# EAGLE design IQRB-1_Evo_board (EAGLE 9.7.0)
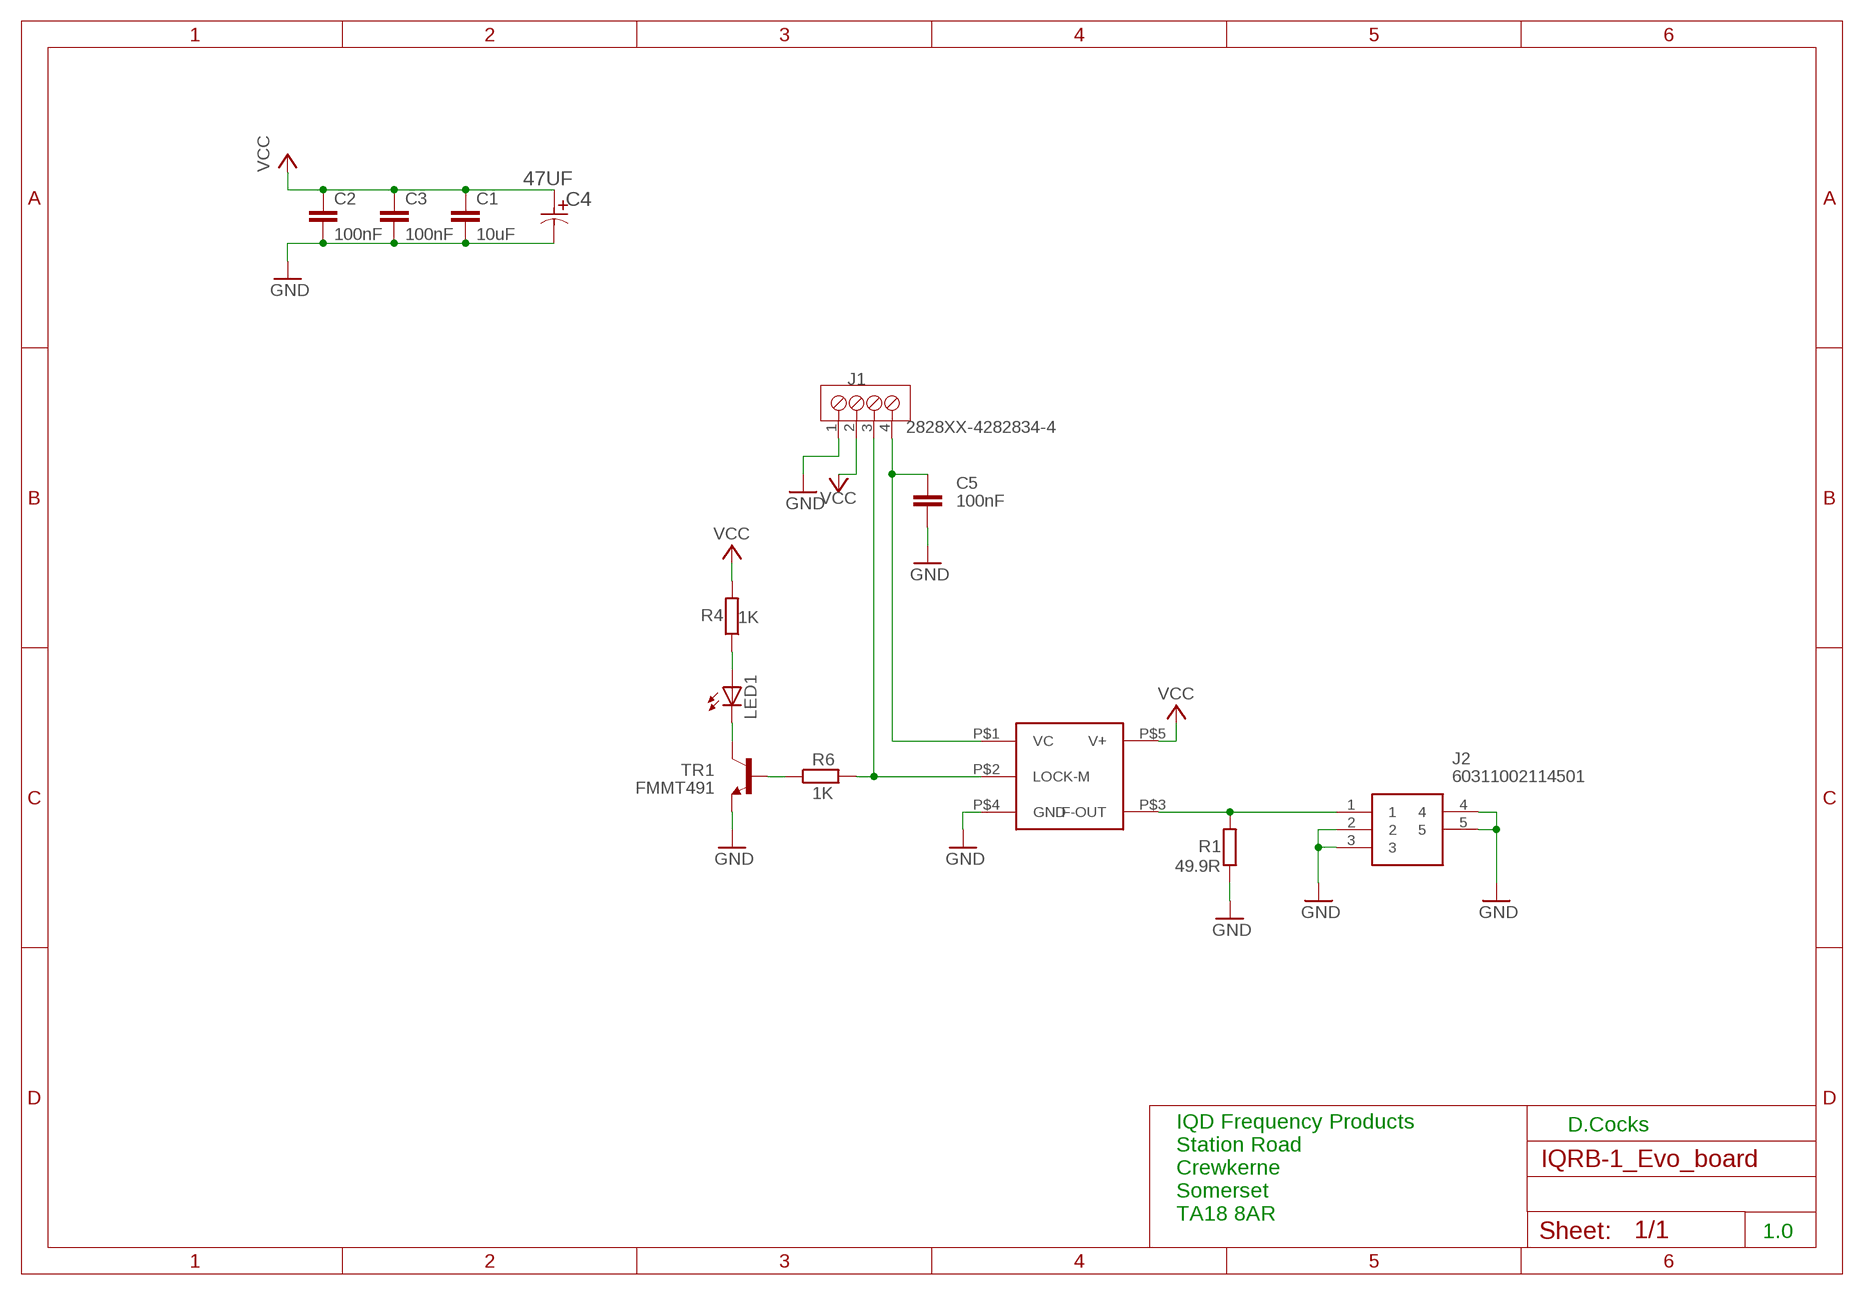
[diagram p0: schematic, sheet 1]

## Parts
C1  10uF  C-EUC0805  [C0805]
C2  100nF  C-EUC0805  [C0805]
C3  100nF  C-EUC0805  [C0805]
C4  47UF  EEE-FK0J101UR-CASE-C  [CAPAE530X610N]
C5  100nF  C-EUC0805  [C0805]
J1  2828XX-4282834-4  [TERMBLK_254-4N]
J2  60311002114501  60312002114503  [60312002114503]
LED1  LEDCHIP-LED0805  [CHIP-LED0805]
R1  49.9R  R-EU_M1206  [M1206]
R4  1K  R-EU_M0805  [M0805]
R6  1K  R-EU_M0805  [M0805]
TR1  FMMT491  BC817-16LT1SMD  [SOT23-BEC]
U$1  RB1-DEVRUBID  [RB1-PACK]

## Nets
GND: C1.2 C2.2 C3.2 C4.2 C5.2 J1.1 J2.2 J2.3 J2.4 J2.5 R1.1 TR1.E U$1.P$4(GND)
N$1: R6.1 TR1.B
N$2: J2.1 R1.2 U$1.P$3(F-OUT)
N$3: LED1.C TR1.C
N$4: LED1.A R4.1
N$5: J1.3 R6.2 U$1.P$2(LOCK-M)
N$6: C5.1 J1.4 U$1.P$1(VC)
VCC: C1.1 C2.1 C3.1 C4.1 J1.2 R4.2 U$1.P$5(V+)

## Notes on the sheet
- D.Cocks
- IQD Frequency Products
  Station Road
  Crewkerne
  Somerset
  TA18 8AR
- 1.0

## Library data of the parts
C1-C3 C5 = resistor:C-EU: CAPACITOR, European symbol
C4 = Panasonic-EEEFK_EEEFP:EEE-: Aluminum Electrolytic Capacitors,Surface Mount Type; MPN: EEE-FK0J101UR; OC_FARNELL: 1850085; OC_NEWARK: 23T0829; PACKAGE: CASE-C; SUPPLIER: PANASONIC; TOLERANCE: ±20 %; VALUE: 100UF; VOLTAGERATING: 6.3V
J1 = Connector:2828XX-4: 4 Position Wire to Board Terminal Block Horizontal with Board Reference: Datasheet <https://www.te.com.cn/commerce/DocumentDelivery/DDEController?Action=showdoc&DocId=Catalog+Section%7F1308389_EUROSTYLE_TERMINAL_BLOCKS%7F0607%7Fpdf%7FEnglish%7FENG_CS_1308389_EUROSTYLE_TERMINAL_BLOCKS_0607.pdf%7F2-282837-5>; CATEGORY: Connectors; DATASHEET: https://www.te.com/usa-en/product-282834-4.datasheet.pdf; DESCRIPTION: 4 Position Wire to Board Terminal Block Horizontal with Board 0.100" (2.54mm) Through Hole; MANUFACTURER: TE Connectivity AMP Connectors; MPN: 282834-4; OPERATING_TEMPERATURE: -40°C ~ 105°C; PACKAGE_SIZE: NA; PACKAGE_TYPE: Through Hole; PART_STATUS: Active; PITCH: 0.100" (2.54mm); ROHS: Compliant; SERIES: Buchanan; SUBCATEGORY: Terminal Blocks; TYPE: Screw Terminal - Rising Cage Clamp Side Wire Entry
J2 = 60312002114503:60312002114503: Wurth Elektronik, WR-SMA Straight PCB Mount Coaxial Connector, jack, Gold over Nickel, Solder Termination Source: Datasheet <https://katalog.we-online.de/em/datasheet/60312002114503.pdf>; DESCRIPTION: Wurth Elektronik, WR-SMA Straight PCB Mount Coaxial Connector, jack, Gold over Nickel, Solder Termination; HEIGHT: 9.56mm; MANUFACTURER_NAME: Wurth Elektronik; MANUFACTURER_PART_NUMBER: 60312002114503; MOUSER_PART_NUMBER: 710-60312002114503; MOUSER_PRICE-STOCK: https://www.mouser.co.uk/ProductDetail/Wurth-Elektronik/60312002114503?qs=3jNSNtuqJTL%2FGpZA1FAOxw%3D%3D
LED1 = led:LED: LED OSRAM: - CHIPLED LG R971, LG N971, LY N971, LG Q971, LY Q971, LO R971, LY R971 LH N974, LH R974 LS Q976, LO Q976, LY Q976 LO Q996 - Hyper CHIPLED LW Q18S LB Q993, LB Q99A, LB R99A - SideLED LS A670, LO A670, LY A670, LG A670, LP A670 LB A673, LV A673, LT A673, LW A673 LH A674 LY A675 LS A676, LA A676, LO A676, LY A676, LW A676 LS A679, LY A679, LG A679 - Hyper Micro SIDELED® LS Y876, LA Y876, LO Y876, LY Y876 LT Y87S - SmartLED LW L88C, LW L88S LB L89C, LB L89S, LG L890 LS L89K, LO L89K, LY L89K LS L896, LA L896, LO L896, LY L896 - TOPLED LS T670, LO T670, LY T670, LG T670, LP T670 LSG T670, LSP T670, LSY T670, LOP T670, LYG T670 LG T671, LOG T671, LSG T671 LB T673, LV T673, LT T673, LW T673 LH T674 LS T676, LA T676, LO T676, LY T676, LB T676, LH T676, LSB T676, LW T676 LB T67C, LV T67C, LT T67C, LS T67K, LO T67K, LY T67K, LW E67C LS E67B, LA E67B, LO E67B, LY E67B, LB E67C, LV E67C, LT E67C LW T67C LS T679, LY T679, LG T679 LS T770, LO T770, LY T770, LG T770, LP T770 LB T773, LV T773, LT T773, LW T773 LH T774 LS E675, LA E675, LY E675, LS T675 LS T776, LA T776, LO T776, LY T776, LB T776 LHGB T686 LT T68C, LB T68C - Hyper Mini TOPLED® LB M676 - Mini TOPLED Santana® LG M470 LS M47K, LO M47K, LY M47K Source: http://www.osram.convergy.de LUXEON: - LUMILED® LXK2-PW12-R00, LXK2-PW12-S00, LXK2-PW14-U00, LXK2-PW14-V00 LXK2-PM12-R00, LXK2-PM12-S00, LXK2-PM14-U00 LXK2-PE12-Q00, LXK2-PE12-R00, LXK2-PE12-S00, LXK2-PE14-T00, LXK2-PE14-U00 LXK2-PB12-K00, LXK2-PB12-L00, LXK2-PB12-M00, LXK2-PB14-N00, LXK2-PB14-P00, LXK2-PB14-Q00 LXK2-PR12-L00, LXK2-PR12-M00, LXK2-PR14-Q00, LXK2-PR14-R00 LXK2-PD12-Q00, LXK2-PD12-R00, LXK2-PD12-S00 LXK2-PH12-R00, LXK2-PH12-S00 LXK2-PL12-P00, LXK2-PL12-Q00, LXK2-PL12-R00 Source: www.luxeon.com KINGBRIGHT: KA-3528ASYC Source: www.kingbright.com
R1 R4 R6 = resistor:R-EU_: RESISTOR, European symbol
TR1 = transistor-npn:BC817*: NPN Transistor
U$1 = IQDcrystal:RB1-DEV

## Board
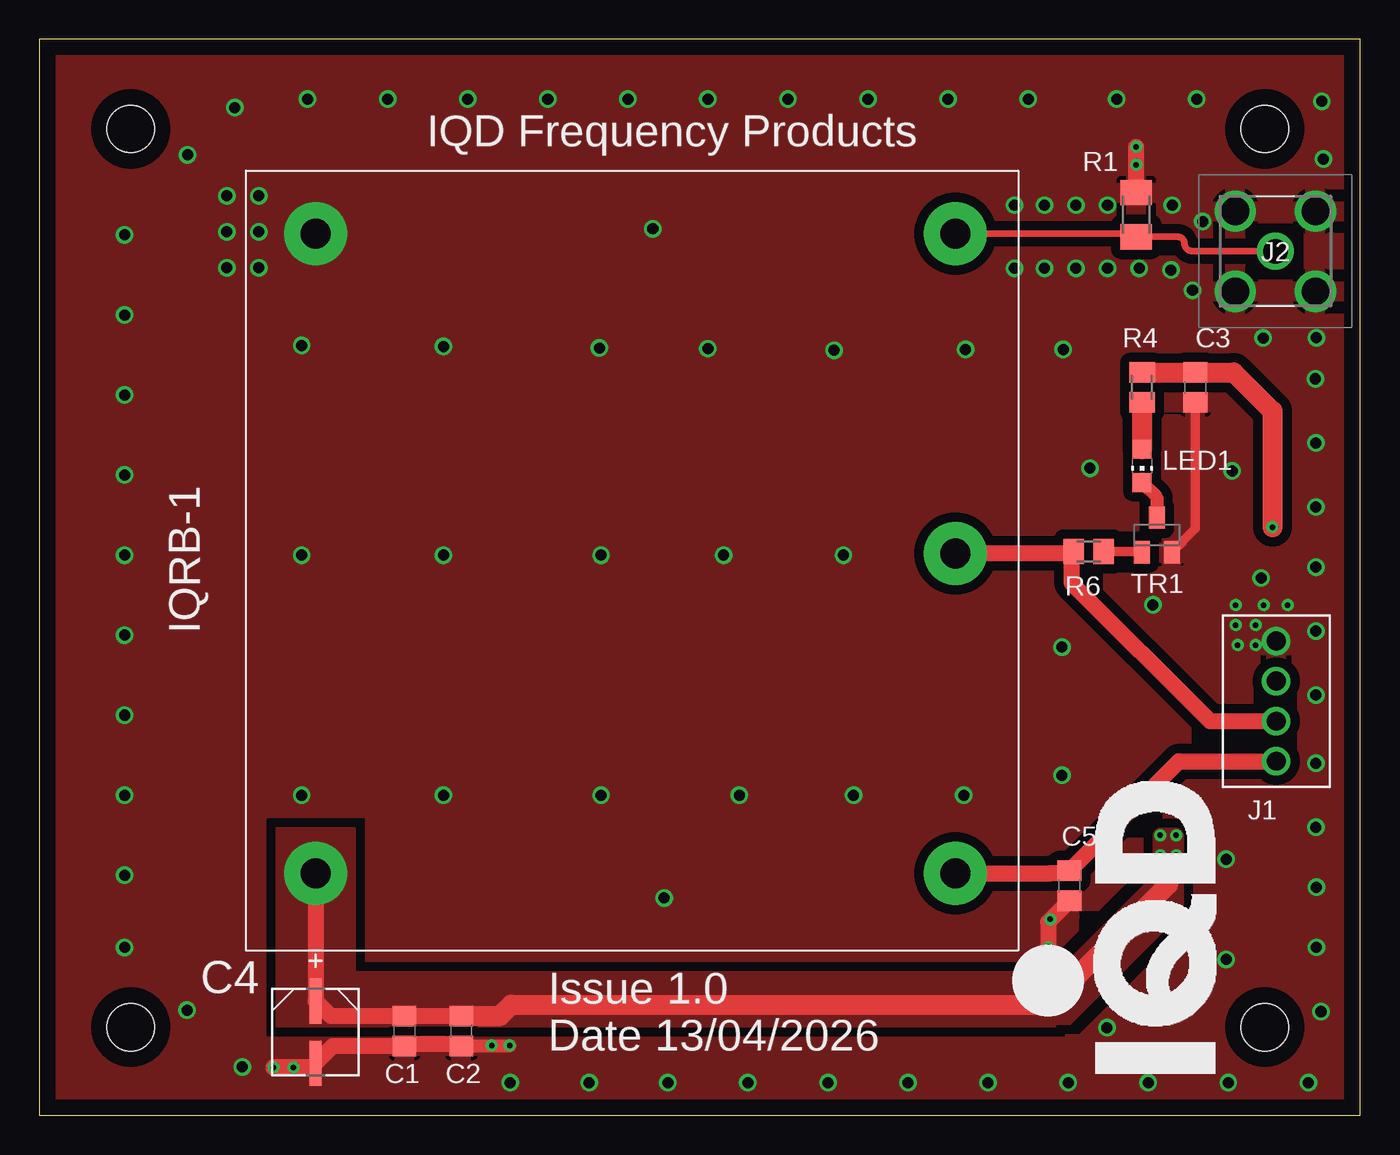
[diagram p1: board, top side]
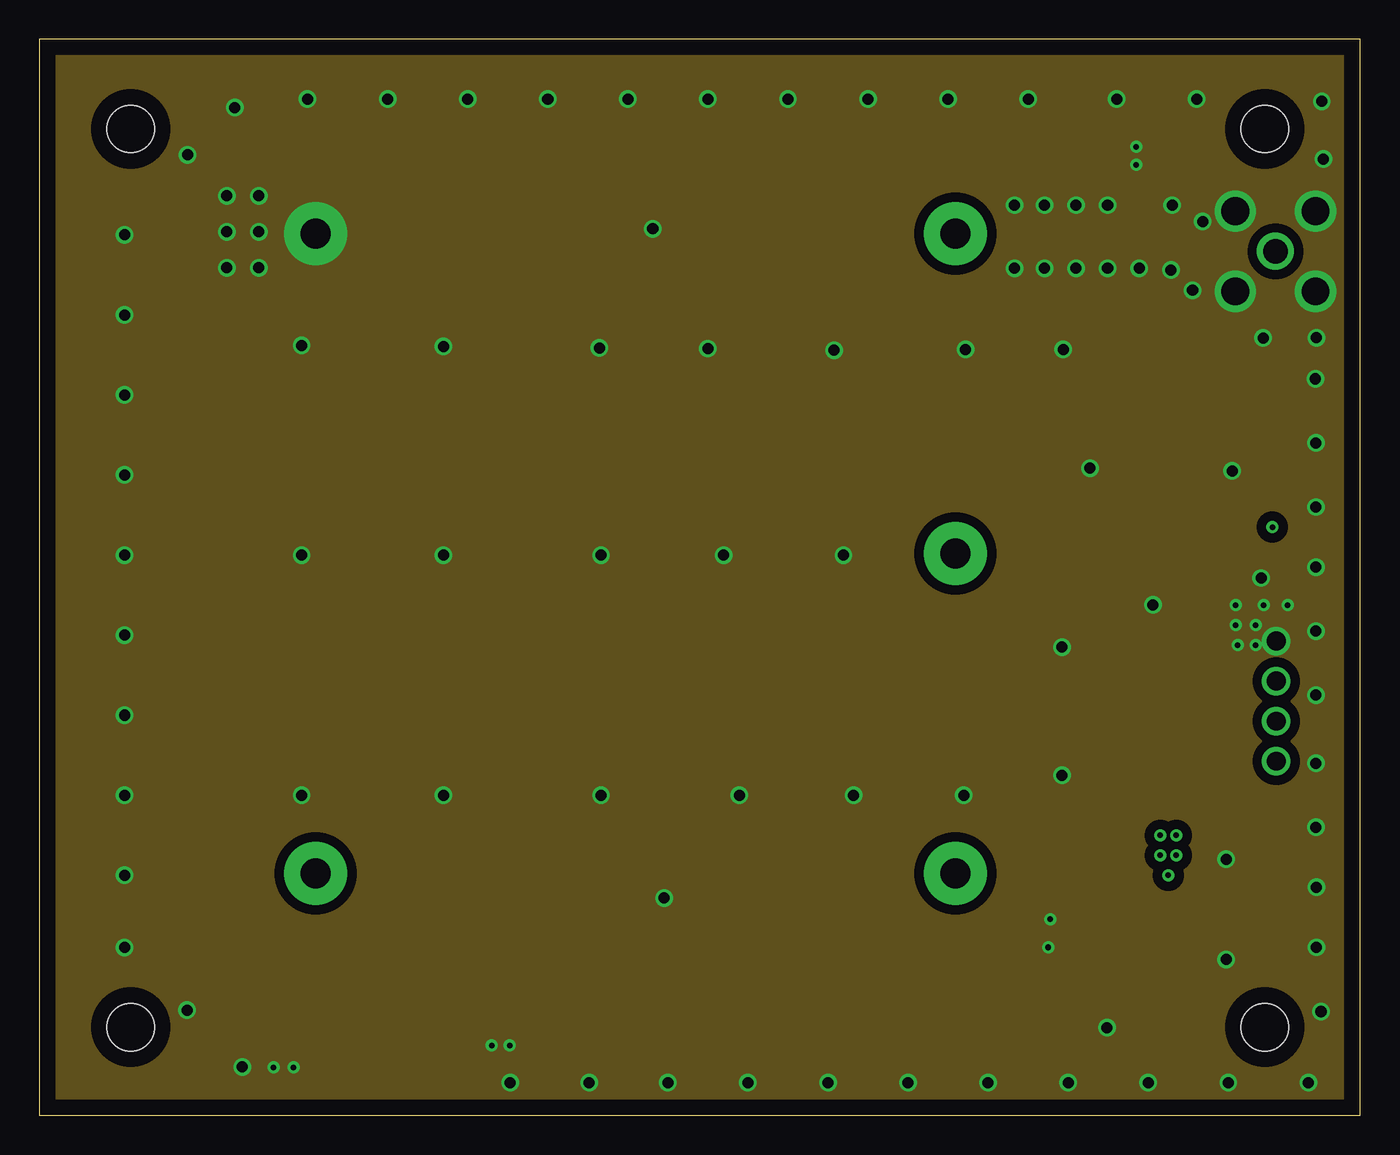
[diagram p2: board, inner layer Route2]
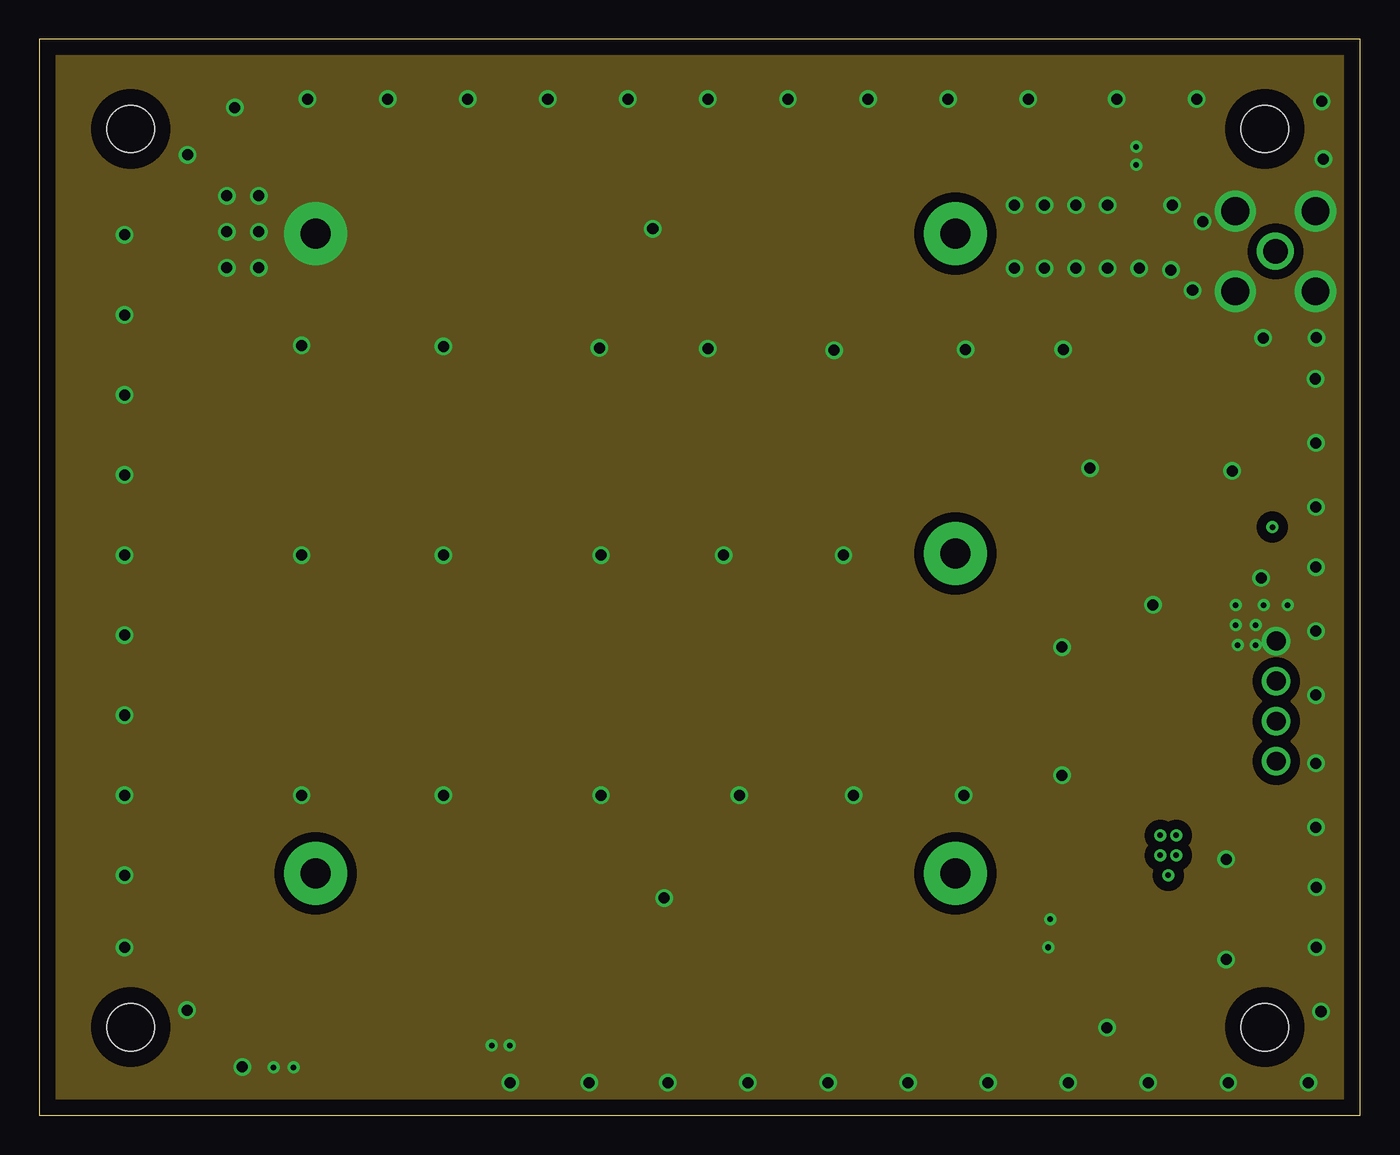
[diagram p3: board, inner layer Route15]
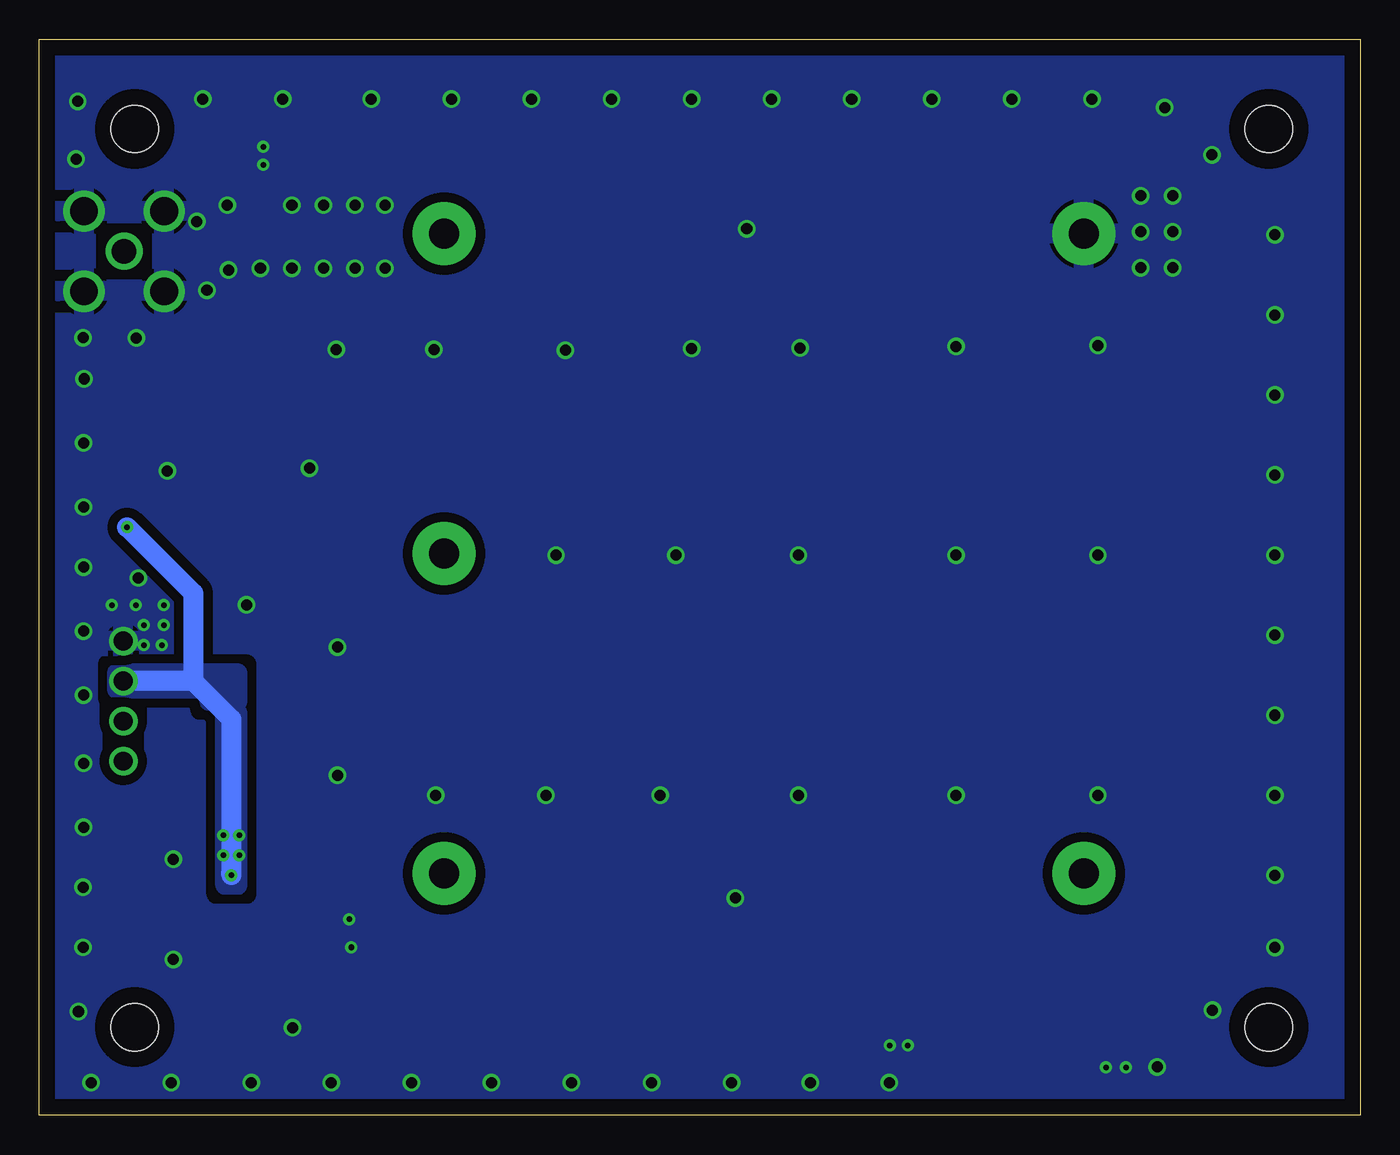
[diagram p4: board, bottom side, seen from below]

Size 83.8 x 68.28 mm. Coordinates in mm from the lower left corner, seen from the top.
Outline: 0,0 83.8,0 83.8,68.28 0,68.28 0,0
Copper layers (1+2*15+16): Top 0.035mm / dielectric 1.5mm / Route2 0.035mm / dielectric 0.15mm / Route15 0.035mm / dielectric 0.2mm / Bottom 0.035mm
Design rules "Fusion Electronics Design Rules *": minimum track width 6mil, minimum drill 0.35mm, track to track 0.6mm, track to pad 0.6mm, pad to pad 6mil, via to via 6mil, smd to smd 6mil, copper to edge 40mil, drill to drill 6mil, minimum pad ring 10mil, minimum via ring 8mil, stop-mask expansion 4mil, vias tented up to drill 0mil, thermal gap 10mil
Holes 3 mm at 5.79,62.6 5.79,5.6 77.75,5.6 77.75,62.6

### Footprints (pad centres in the part's own frame; a part is rotated, then mirrored left to right if it is on the bottom)
C0805 = smd 1.3 x 1.5: 1 -0.95,0; 2 0.95,0
CAPAE530X610N = smd 2.87 x 0.762: 1 -1.981,0; 2 1.981,0
TERMBLK_254-4N = drill 1.2: 1 0,0; 2 2.54,0; 3 5.08,0; 4 7.62,0
60312002114503 = drill 1.55 pad 2.325: 1 0,0 | drill 1.75 pad 2.625: 2 -2.54,-2.54; 3 -2.54,2.54; 4 2.54,-2.54; 5 2.54,2.54
CHIP-LED0805 = smd 1.2 x 1.2: A 0,-1.05; C 0,1.05
M1206 = smd 1.6 x 2: 1 -1.4,0; 2 1.4,0
M0805 = smd 1.3 x 1.6: 1 -0.95,0; 2 0.95,0
SOT23-BEC = smd 1 x 1.4: B -0.95,-1.1; C 0,1.1; E 0.95,-1.1
RB1-PACK = drill 1.9 pad 4: P$1 0,40.6; P$2 0,20.3; P$3 0,0; P$4 40.6,0; P$5 40.6,40.6

### Placement (x,y rotation side)
C1  23.16,5.36 270 top
C2  26.77,5.36 270 top
C3  73.34,46.2 270 top
C4  17.53,5.28 270 top
C5  65.35,14.58 270 top
J1  78.48,30.1 270 top
J2  78.42,54.84 0 top
LED1  69.96,41.22 180 top
R1  69.6,57.15 270 top
R4  69.96,46.2 90 top
R6  66.57,35.79 180 top
TR1  70.9,36.84 0 top
U$1  58.12,55.96 180 top

### Tracks (layer width: path | path; a pad name or v marks a point on that pad's centre or on a via)
GND  (via drill 0.35, 0.7)
  Top 0.61: C3.2 73.34,37.23 TR1.E
  Top 0.813: 26.58,4.6 C2.2 29.81,4.41 v29.84,4.45
  Top 1.016: 73.48,45.4 C3.2 | 26.58,4.55 23.31,4.55 C1.2 18.63,4.41 C4.2 17.27,3.05 v14.86,3.05 | R1.1 v69.6,61.47 | C5.2 64.01,12.28 v64.01,10.67
  other vias: 9.4,60.96 5.4,55.88 5.4,50.8 5.4,45.72 5.4,40.64 5.4,35.56 5.4,30.48 5.4,25.4 5.4,20.32 5.4,15.24 5.4,10.66 9.36,6.68 39.88,2.08 44.96,2.08 50.04,2.08 55.12,2.08 60.2,2.08 65.28,2.08 70.36,2.08 75.44,2.08 80.52,2.08 81.03,10.67 81.03,14.48 80.99,18.29 80.99,22.35 80.99,26.67 80.99,30.73 80.99,34.8 80.99,38.61 80.99,42.67 73.44,64.5 68.36,64.5 62.74,64.5 57.66,64.5 52.58,64.5 47.5,64.5 42.42,64.5 37.34,64.5 25.64,48.8 25.64,20.32 51.66,20.32 58.76,48.6 43.42,35.56 25.64,35.56 44.42,20.32 42.42,48.66 63.78,53.76 65.78,53.76 67.78,53.76 69.78,53.76 63.78,57.76 65.78,57.76 67.78,57.76 32.26,64.5 27.18,64.5 22.1,64.5 17.02,64.5 81.37,64.35 34.88,2.08 29.88,2.08 12.88,3.08 12.4,63.95 16.64,35.56 16.64,48.86 35.54,48.7 50.42,48.56 39.64,13.8 38.92,56.26 16.64,20.32 35.64,20.32 35.64,35.56 58.66,20.32 51.02,35.56 64.96,48.6 70.66,32.4 66.66,41.07 64.88,29.72 67.74,5.58 81.32,6.59 73.17,52.37 81.02,49.35 71.88,57.76 80.96,46.74 81.47,60.69 75.3,16.25 75.3,9.9 64.88,21.59 77.66,49.33 75.68,40.89 77.53,34.11 75.91,31.12 73.81,56.73 71.8,53.65 69.6,60.32 64.14,12.45 76.04,29.84 28.7,4.45 16.13,3.05 61.87,57.76 61.87,53.76 13.92,58.36 13.92,56.08 13.92,53.79 11.89,58.36 11.89,56.08 11.89,53.79 77.18,31.12 77.18,29.84 75.91,32.38 77.69,32.38 79.21,32.38
  pour Bottom (rank 2): -1.52,-3.1 95.89,-3.1 95.89,1.46 95.85,1.57 95.82,1.69 95.82,67.26 95.82,67.26 95.82,67.32 95.82,67.38 95.82,67.38 95.82,67.38 95.82,67.39 95.87,71.63 -1.32,71.63
  pour Top (rank 2): -4.82,-8.34 101.7,-8.39 101.63,-4.93 101.63,-4.92 101.63,-4.87 101.62,-4.81 101.63,-4.8 101.63,75.18 -6.18,75.18
  pour Route2 (no thermals): -9.58,-12.62 107.11,-12.62 107.11,77.39 -9.58,77.39
  pour Route15 (no thermals): -12.12,-15.16 108.38,-15.16 108.38,79.93 -12.12,79.93
  pour Top (no thermals): 10.74,52.91 19.99,52.91 19.99,59.11 10.74,59.11
  pour Top (no thermals): 76.07,29.84 79.38,29.84 79.38,32.38 76.07,32.38
N$1
  Top 0.61: R6.1 69.9,35.79 TR1.B
N$2
  Top 0.406: U$1.P$3 69.39,55.96 R1.2 72.27,55.75 arc-90 72.64,55.37 arc90 73.17,54.84 J2.1
N$3
  Top 0.813: LED1.C 70.9,39.24 TR1.C
N$4
  Top 1.27: R4.1 LED1.A
N$5
  Top 1.016: 65.49,35.66 U$1.P$2 | 65.49,35.66 R6.2 | 65.49,35.66 65.49,33.8 74.27,25.02 J1.3
N$6
  Top 1.016: U$1.P$1 64.11,15.36 64.14,15.39 65.21,15.39 C5.1 72.31,22.48 J1.4
VCC  (via drill 0.35)
  Top 1.016: U$1.P$5 17.52,7.27 C4.1 18.48,6.31 C1.1 C2.1
  Top 1.27: R4.2 C3.1 75.78,47.15 78.23,44.7 v78.23,37.34 | C2.1 29.22,6.31 29.95,7.04 64.01,7.04 71.63,14.66 v71.63,15.24
  Bottom 1.27: 74.04,27.56 71.63,25.15 v71.63,15.24 71.63,15.5 | 74.04,27.56 J1.2 | v78.23,37.34 74.04,33.15 74.04,27.56
  other vias: 71.12,17.78 71.12,16.51 72.14,17.78 72.14,16.51
  pour Top (no thermals): 64.44,5.66 64.44,9.07 20.05,9.07 20.02,9.08 20,9.1 19.99,9.13 19.99,18.21 15.06,18.21 15.06,5.66
  pour Top (no thermals): 71.17,14.94 71.11,14.84 64.9,8.63 64.9,6.11 72.01,13.22 72.01,17.65 71.25,17.65 71.25,15.18 71.22,15.05
  pour Bottom (no thermals): 71.25,14.61 72.01,14.61 72.01,25.53 71.25,25.53
  pour Bottom (no thermals): 73.47,27.03 73.6,27.05 78.87,27.05 78.87,28.07 71.25,28.07 71.25,26.29 73.03,26.29 73.03,26.48 73.05,26.6 73.1,26.72 73.17,26.82 73.26,26.91 73.36,26.98

### Text on the board
tPlace: IQD Frequency Products | IQRB-1 | Issue 1.0 / Date 13/04/2026